# Altium schematic sheet Sensors.SchDoc
size A3; SheetNumber: 1; SheetTotal: 3
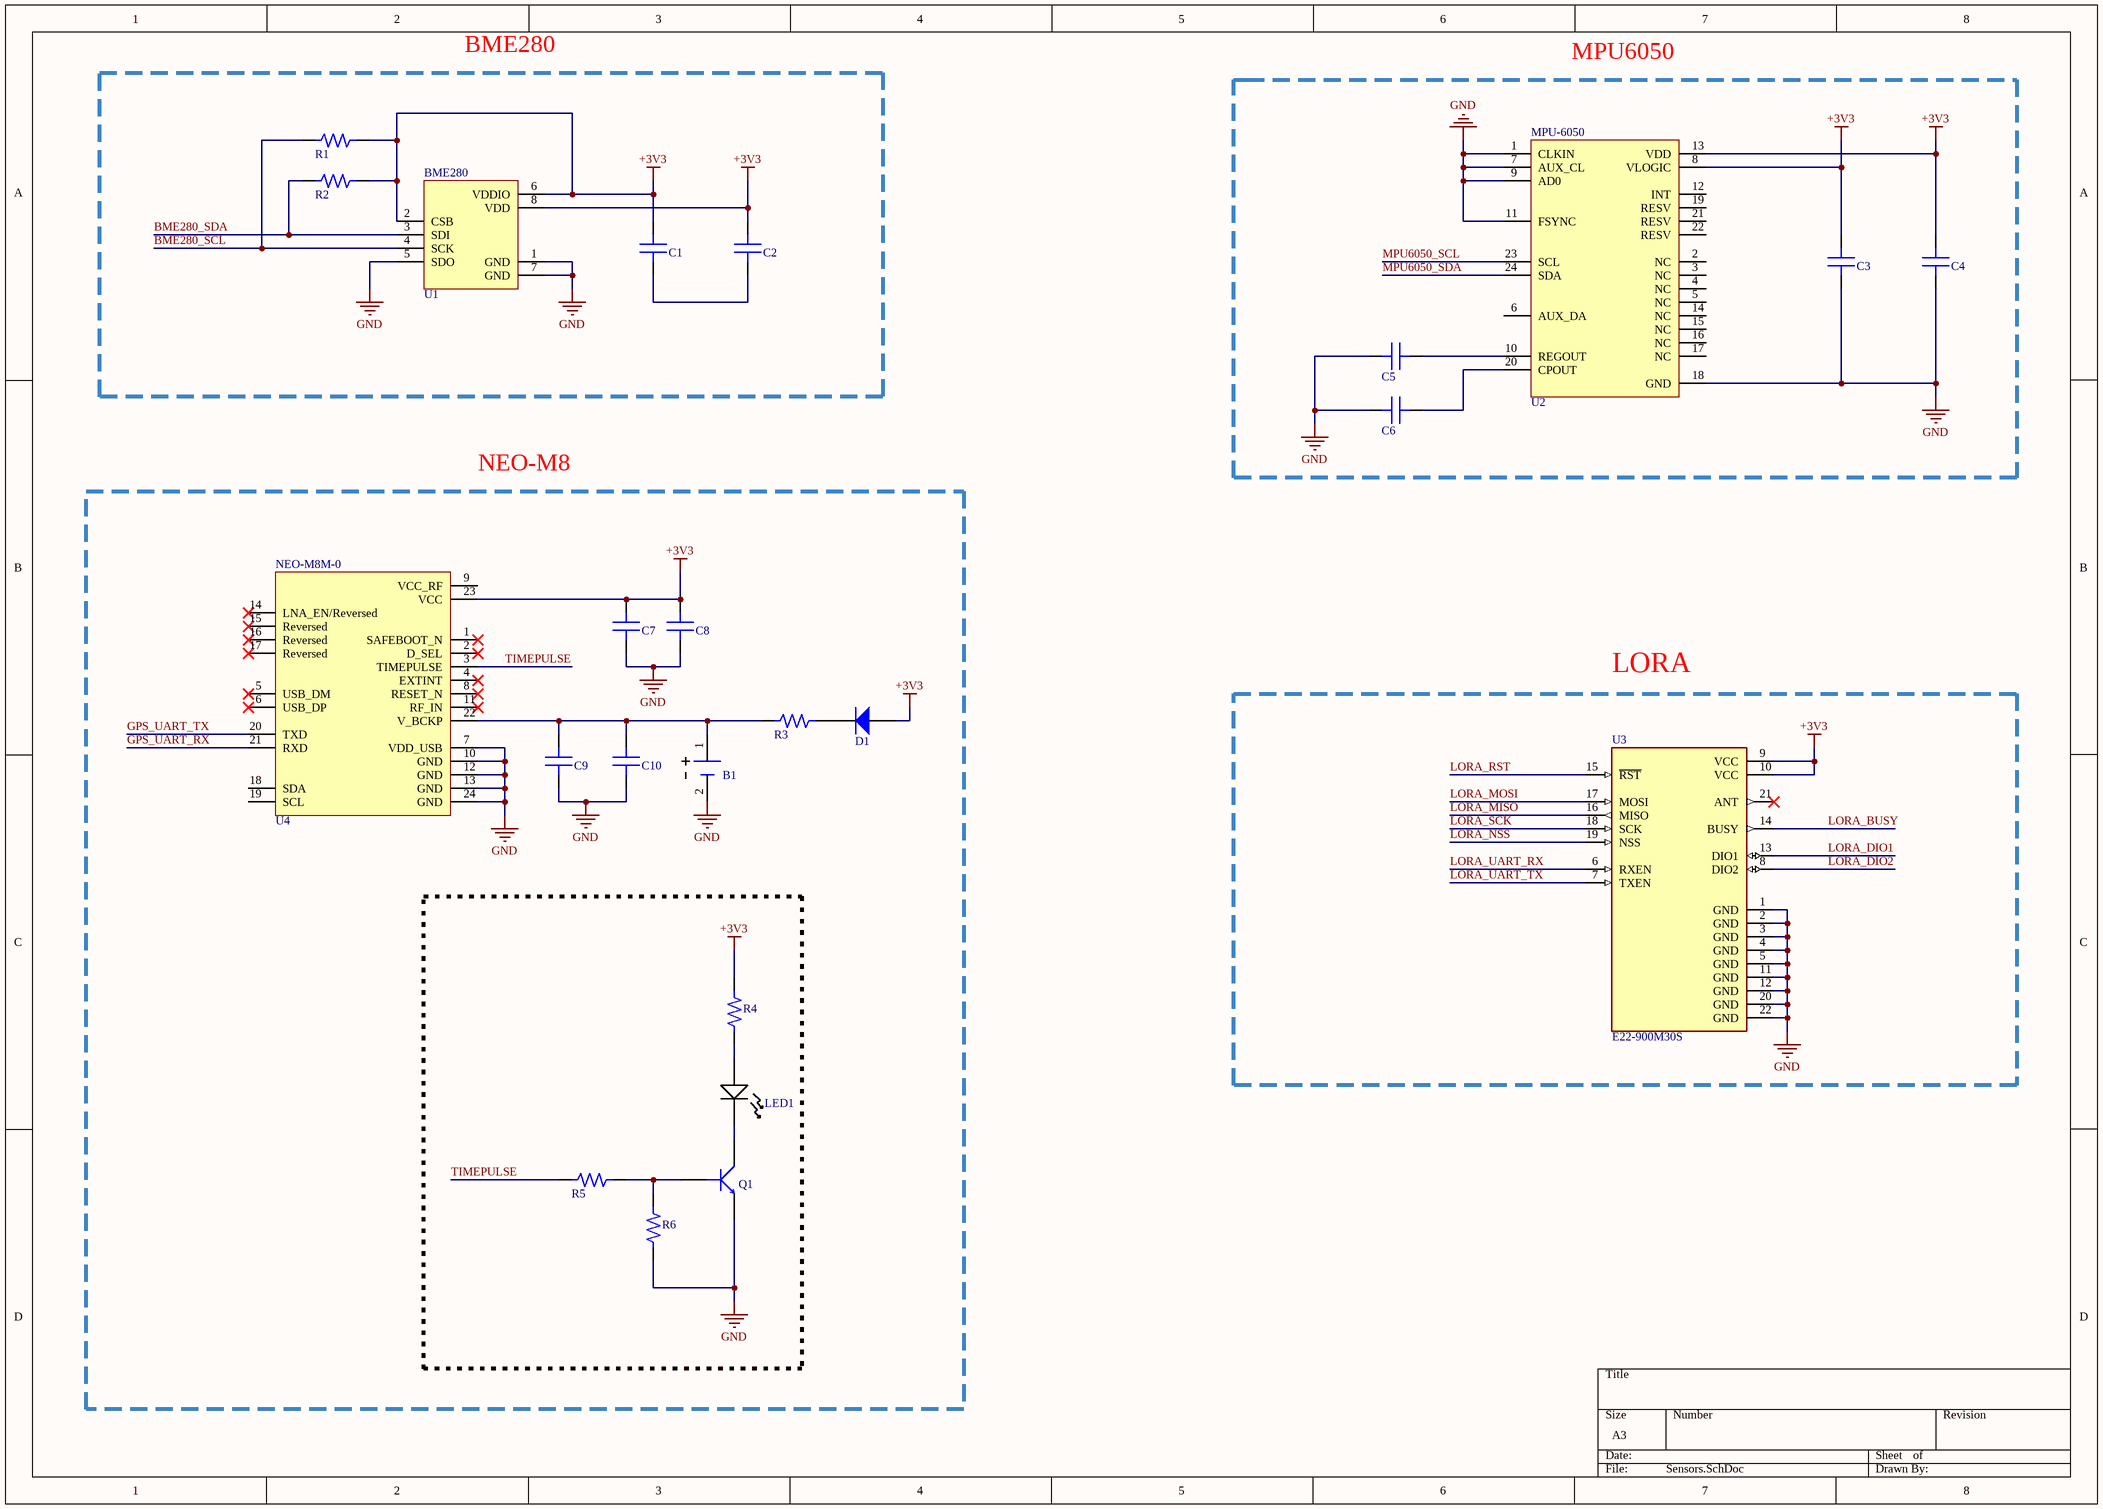
[diagram p0: Sensors.SchDoc]

## Parts
B1  MS920SE-FL27E  [MS920SE_Battery]  (value not drawn)
C1  CAP CER 100nF 0805  [CAP_0805]  (value not drawn)
C2  CAP CER 100nF 0805  [CAP_0805]  (value not drawn)
C3  CAP CER 10nF 0805  [CAP_0805]  (value not drawn)
C4  CAP CER 0.1uF 0805  [CAP_0805]  (value not drawn)
C5  CAP CER 0.1uF 0805  [CAP_0805]  (value not drawn)
C6  CAP CER 2.2nF 0805  [CAP_0805]  (value not drawn)
C7  CAP CER 10uF 0805  [CAP_0805]  (value not drawn)
C8  CAP CER 100nF 0805  [CAP_0805]  (value not drawn)
C9  CAP CER 4.7uF 0805  [CAP_0805]  (value not drawn)
C10  CAP CER 100nF 0805  [CAP_0805]  (value not drawn)
D1  DIODE GEN PURP 75V 150MA SOD323F  [SOD323F]  (value not drawn)
LED1  CMD17-21VRD/TR8  [LED RED_0805]  (value not drawn)
Q1  MMBT3904-7-F  [SOT_23F]  (value not drawn)
R1  RES 4.7K OHM 0805  [RES_0805]  (value not drawn)
R2  RES 4.7K OHM 0805  [RES_0805]  (value not drawn)
R3  RES 1K OHM 0805  [RES_0805]  (value not drawn)
R4  RES 1K OHM 0805  [RES_0805]  (value not drawn)
R5  RES 10K OHM 0805  [RES_0805]  (value not drawn)
R6  RES 10K OHM 0805  [RES_0805]  (value not drawn)
U1  BME280  [BME280]
U2  MPU-6050  [QFN-24-MPU6050]
U3  E22-900M30S  [LORA]
U4  NEO-M8M-0  [NEO-M8-GPS]

## Blocks framed on the sheet
BME280: C1 C2 R1 R2 U1
MPU6050: C3-C6 U2
NEO-M8: B1 C7-C10 D1 LED1 Q1 R3-R6 U4
LORA: U3

## Nets
+3V3: C1.2 C2.2 C3.2 C4.2 C7.2 C8.2 D1.2(ANODE) R1.2 R2.2 R4.2 U1.2(CSB) U1.6(VDDIO) U1.8(VDD) U2.8(VLOGIC) U2.13(VDD) U3.9(VCC) U3.10(VCC) U4.23(VCC)
GND: B1.2 C3.1 C4.1 C5.1 C6.1 C7.1 C8.1 C9.1 C10.1 Q1.2(E) R6.1 U1.1(GND) U1.5(SDO) U1.7(GND) U2.1(CLKIN) U2.7(AUX_CL) U2.9(AD0) U2.11(FSYNC) U2.18(GND) U3.1(GND) U3.2(GND) U3.3(GND) U3.4(GND) U3.5(GND) U3.11(GND) U3.12(GND) U3.20(GND) U3.22(GND) U4.7(VDD_USB) U4.10(GND) U4.12(GND) U4.13(GND) U4.24(GND)
BME280_SCL: R1.1 U1.4(SCK)
BME280_SDA: R2.1 U1.3(SDI)
GPS_UART_RX: U4.21(RXD)
GPS_UART_TX: U4.20(TXD)
LORA_BUSY: U3.14(BUSY)
LORA_DIO1: U3.13(DIO1)
LORA_DIO2: U3.8(DIO2)
LORA_MISO: U3.16(MISO)
LORA_MOSI: U3.17(MOSI)
LORA_NSS: U3.19(NSS)
LORA_RST: U3.15(~{RST})
LORA_SCK: U3.18(SCK)
LORA_UART_RX: U3.6(RXEN)
LORA_UART_TX: U3.7(TXEN)
MPU6050_SCL: U2.23(SCL)
MPU6050_SDA: U2.24(SDA)
TIMEPULSE: R5.1 U4.3(TIMEPULSE)
NetB1_1: B1.1 C9.2 C10.2 R3.1 U4.22(V_BCKP)
NetC1_1: C1.1 C2.1
NetC5_2: C5.2 U2.10(REGOUT)
NetC6_2: C6.2 U2.20(CPOUT)
NetD1_1: D1.1(CATHODE) R3.2
NetLED1_1: LED1.1 R4.1
NetLED1_2: LED1.2 Q1.3(C)
NetQ1_1: Q1.1(B) R5.2 R6.2

Not connected (* = marked no-connect by the designer): U2 2(NC) 3(NC) 4(NC) 5(NC) 6(AUX_DA) 12(INT) 14(NC) 15(NC) 16(NC) 17(NC) 19(RESV) 21(RESV) 22(RESV); U3 21(ANT)*; U4 1(SAFEBOOT_N)* 2(D_SEL)* 4(EXTINT)* 5(USB_DM)* 6(USB_DP)* 8(RESET_N)* 9(VCC_RF) 11(RF_IN)* 14(LNA_EN/Reversed)* 15(Reversed)* 16(Reversed)* 17(Reversed)* 18(SDA) 19(SCL)

## Notes on the sheet
- (near R1) SDO nun GND ye bağlanması sonucu slave adres 1110110(0x76) olur
- (near U4) USB İLE DEĞİL UART İLE HABERLEŞİYOR
- RF antenlerle ilgili olmalı?
- (near U4) KULLANILACAK MI ? UART İÇİN RX-TX KULLANILIYOR..
- SORU İŞARETİ???
  XBEE İŞLEMCİYE GİTMEDEN ÖNCE KONNEKTÖRE GİDECEK
  İŞLEMCİ - USB - KONNEKTÖR
  acaba xbee den çıkan rx tx pinleri usb to uart yaptığımız ch340n den çıkan rx tx pinlerine mi gidecek????
- https://image.easyeda.com/components/a3499788020748ef87e202bcfc8d7515.png

## Library data of the parts
B1 = BATTERY: Lithium Battery Coin 3V 11mAh Rechargeable Tray; Manufacturer: Epson; Capacity: 0.011ah; Number of Cells: 1; Supplier 1: Digi-Key; Manufacturer Part Number: MS920SE-FL27E; RoHS: No; Stock 1: 17863; Pricing 1: 1=2,520000, 10=2,091000, 50=1,844000, 100=1,741000, 300=1,617400, 500=1,535000, 1000=1,452580, 2500=1,380470 (USD); Mount: Screw; Min Operating Temperature: -20°C; Max Operating Temperature: 60°C; Chemistry/Technology: Lithium; Voltage: 3V; ComponentLink1URL: http://speed.sii.co.jp/data/file_PRODUCT_MASTER_50112_TITLE_IMAGESP.pdf?src-supplier=Avnet; ComponentLink1Description: http://speed.sii.co.jp/data/file_PRODUCT_MASTER_50112_TITLE_IMAGESP.pdf?src-supplier=Avnet; Supplier Part Number 1: 728-1058-ND
D1 = DIODE: VR=75V IF=150mA Trr=4ns P=200mW; Manufacturer: ON Semiconductor / Fairchild; Manufacturer Part Number: 1N4148WS; Element Configuration: Single; Reverse Recovery Time: 4ns; Forward Voltage: 1V; Max Reverse Current: 5uA; Power Dissipation: 200mW; Max Forward Surge Current (Ifsm): 2A; Supplier 1: Digi-Key; RoHS: Yes; Category: Rectifier Diodes; Stock 1: 973654; Pricing 1: 1=0,21000, 10=0,19200, 100=0,10460, 500=0,06436, 1000=0,04388 (USD); Mount: Surface Mount; Number of Pins: 2; Contact Plating: Tin,Matte; Weight: 0.0276g; Min Operating Temperature: -55°C; Max Operating Temperature: 150°C; Packaging: Tape and Reel; Forward Current: 150mA; Max Repetitive Reverse Voltage (Vrrm): 75V; Package Quantity: 1; Average Rectified Current: 150mA; Max Reverse Voltage (DC): 75V; Recovery Time: 4ns; Series: -; Reverse Voltage: 75V; Length: 1.8mm; Width: 1.35mm; Height: 1mm; Radiation Hardening: No; RoHS Compliant: Yes; Lead Free: Lead Free; Reach SVHC Compliant: Yes; ComponentLink1URL: https://datasheet.ciiva.com/30479/0900766b810e1cd3-30479206.pdf?src-supplier=Rs; ComponentLink1Description: https://datasheet.ciiva.com/30479/0900766b810e1cd3-30479206.pdf?src-supplier=Rs; ComponentLink2URL: https://datasheet.ciiva.com/15208/getdatasheetpartid-127819-15208358.pdf?src-supplier=Verical; ComponentLink2Description: https://datasheet.ciiva.com/15208/getdatasheetpartid-127819-15208358.pdf?src-supplier=Verical; ComponentLink3URL: https://datasheet.ciiva.com/8300/1n914bws-8300360.pdf?src-supplier=Avnet; ComponentLink3Description: https://datasheet.ciiva.com/8300/1n914bws-8300360.pdf?src-supplier=Avnet; ComponentLink4URL: https://datasheet.ciiva.com/910/1n4148ws-910381.pdf?src-supplier=Digi-Key; ComponentLink4Description: https://datasheet.ciiva.com/910/1n4148ws-910381.pdf?src-supplier=Digi-Key; ComponentLink5URL: https://datasheet.ciiva.com/910/1n4148ws-910382.pdf?src-supplier=Digi-Key; ComponentLink5Description: https://datasheet.ciiva.com/910/1n4148ws-910382.pdf?src-supplier=Digi-Key; ComponentLink6URL: https://datasheet.ciiva.com/910/1n4148ws-910380.pdf?src-supplier=Digi-Key; ComponentLink6Description: https://datasheet.ciiva.com/910/1n4148ws-910380.pdf?src-supplier=Digi-Key; Supplier Part Number 1: 1N4148WSFSDKR-ND
LED1 = LED RED: LED Uni-Color Red 640nm 2-Pin SMT T/R; Manufacturer: VCC CHML; Power Rating: 100mW; Luminous Intensity: 6mcd; Viewing Angle: 140°; Lens Style: Diffused,Tinted,Rectangular,Colored; Forward Current: 20mA; Forward Voltage: 2V; Reverse Voltage (DC): 5V; Number of LEDs: 1; Supplier 1: Digi-Key; Manufacturer Part Number: CMD17-21VRD/TR8; RoHS: Yes; Category: LEDs; Stock 1: 357228; Pricing 1: 1=0,73000, 10=0,47800, 100=0,31310, 1000=0,24720 (USD); Mount: Surface Mount; Case/Package: 0805; Number of Pins: 2; Color: Red; Case Code (Metric): 2012; Case Code (Imperial): 0805; Lens Color: Red; Min Operating Temperature: -40°C; Max Operating Temperature: 85°C; Packaging: Tape and Reel; Package Quantity: 1; Illumination Color: Red; Test Current: 20mA; Wavelength: 640nm; Reverse Voltage: 5V; Length: 2mm; Width: 1.25mm; Height: 1.1mm; RoHS Compliant: Yes; Lead Free: Lead Free; ComponentLink1URL: http://www.mouser.com/ds/2/423/CMD1721ver1-1064576.pdf?src-supplier=Mouser; ComponentLink1Description: http://www.mouser.com/ds/2/423/CMD1721ver1-1064576.pdf?src-supplier=Mouser; ComponentLink2URL: https://www.alliedelec.com/m/d/ea8f758becbd32522d2612194452bcae.pdf?src-supplier=Allied+Electronics; ComponentLink2Description: https://www.alliedelec.com/m/d/ea8f758becbd32522d2612194452bcae.pdf?src-supplier=Allied+Electronics; ComponentLink3URL: http://www.onlinecomponents.com/productFiles/mf-CM/2cmd17-21seriessmtleds0805packagesize.pdf?src-supplier=Onlinecomponents.com; ComponentLink3Description: http://www.onlinecomponents.com/productFiles/mf-CM/2cmd17-21seriessmtleds0805packagesize.pdf?src-supplier=Onlinecomponents.com; ComponentLink4URL: https://vcclite.com/wp-content/uploads/wpallimport/files/files/CMD1721Seriesver3.pdf?src-supplier=Digi-Key; ComponentLink4Description: https://vcclite.com/wp-content/uploads/wpallimport/files/files/CMD1721Seriesver3.pdf?src-supplier=Digi-Key; Supplier Part Number 1: L62501CT-ND
Q1 = BJT_NPN: NPN Ic=200mA Vceo=40V hfe=100~300 fT=310MHz P=300mW SOT-23; Manufacturer: Diodes Zetex; Max Power Dissipation: 300mW; Collector Emitter Voltage (VCEO): 40V; Max Collector Current: 200mA; Collector Base Voltage (VCBO): 60V; Power Dissipation: 350mW; Frequency: 300MHz; hFE Min: 100; Number of Elements: 1; Emitter Base Voltage (VEBO): 6V; Collector Emitter Saturation Voltage: 300mV; Element Configuration: Single; Supplier 1: Digi-Key; Manufacturer Part Number: MMBT3904-7-F; RoHS: Yes; Category: BJTs; Stock 1: 7729144; Pricing 1: 1=0,13000, 10=0,11700, 100=0,06370, 500=0,03918, 1000=0,02671 (USD); Mount: Surface Mount; Case/Package: SOT-23; Number of Pins: 3; Weight: 0.000282oz; Contact Plating: Tin,Matte; Min Operating Temperature: -55°C; Max Operating Temperature: 150°C; Polarity: NPN; Packaging: Tape and Reel; Package Quantity: 3000; Transition Frequency: 300MHz; Collector Emitter Breakdown Voltage: 40V; Max Breakdown Voltage: 40V; Continuous Collector Current: 200mA; Max Frequency: 300MHz; Gain Bandwidth Product: 300MHz; Voltage Rating (DC): 40V; Series: Automotive, AEC-Q101; Collector-emitter Voltage-Max: 300mV; Length: 3.05mm; Width: 1.4mm; Height: 1mm; Radiation Hardening: No; Reach SVHC Compliant: Yes; Lead Free: Lead Free; RoHS Compliant: Yes; ComponentLink1URL: https://datasheet.ciiva.com/11201/ds30036-11201778.pdf?src-supplier=Avnet; ComponentLink1Description: https://datasheet.ciiva.com/11201/ds30036-11201778.pdf?src-supplier=Avnet; ComponentLink2URL: https://datasheet.ciiva.com/15138/getdatasheetpartid-53265-15138780.pdf?src-supplier=Verical; ComponentLink2Description: https://datasheet.ciiva.com/15138/getdatasheetpartid-53265-15138780.pdf?src-supplier=Verical; ComponentLink3URL: https://datasheet.ciiva.com/22711/1915516-22711750.pdf?src-supplier=Element14; ComponentLink3Description: https://datasheet.ciiva.com/22711/1915516-22711750.pdf?src-supplier=Element14; ComponentLink4URL: https://datasheet.ciiva.com/11198/ds30036-11198999.pdf?src-supplier=Avnet; ComponentLink4Description: https://datasheet.ciiva.com/11198/ds30036-11198999.pdf?src-supplier=Avnet; ComponentLink5URL: https://datasheet.ciiva.com/6361/ds30036-6361256.pdf?src-supplier=Digi-Key; ComponentLink5Description: https://datasheet.ciiva.com/6361/ds30036-6361256.pdf?src-supplier=Digi-Key; ComponentLink6URL: https://datasheet.ciiva.com/6361/ds30036-6361254.pdf?src-supplier=Digi-Key; ComponentLink6Description: https://datasheet.ciiva.com/6361/ds30036-6361254.pdf?src-supplier=Digi-Key; Supplier Part Number 1: MMBT3904-FDICT-ND
U1 = BME280: Pressure, Temperature and Humidity Sensor Digital Output 1.8V 8-Pin LGA T/R; Manufacturer: Bosch Tools; Supplier 1: Digi-Key; Manufacturer Part Number: BME280; RoHS: No; Category: Pressure Sensors; Stock 1: 180730; Pricing 1: 1=7,64000, 5=6,74200, 10=5,95500, 25=4,83160, 50=4,26960, 100=4,15730, 500=3,48316, 1000=3,25844 (USD); Supplier Part Number 1: 828-1063-1-ND
U2 = MPU6050: IMU ACCEL/GYRO 3-AXIS I2C 24QFN; Manufacturer: TDK InvenSense; Sensor Type: Accelerometer,Gyroscope,6 Axis; Supplier 1: Digi-Key; Manufacturer Part Number: MPU-6050; RoHS: Yes; Category: Inertial Measurement Units (IMUs); Pricing 1: 1=9,11000, 5=7,99200, 10=7,19300, 25=6,39400, 50=5,91440, 100=5,11520, 500=4,79550, 1000=4,47580 (USD); Mount: Surface Mount; Case/Package: QFN; Min Operating Temperature: -40°C; Max Operating Temperature: 85°C; Packaging: Cut Tape; Output Type: I2C; Series: -; RoHS Compliant: Yes; ComponentLink1URL: https://datasheet.ciiva.com/1513/1788002-1513632.pdf?src-supplier=Element14; ComponentLink1Description: https://datasheet.ciiva.com/1513/1788002-1513632.pdf?src-supplier=Element14; ComponentLink2URL: https://datasheet.ciiva.com/22731/1788002-22731434.pdf?src-supplier=Element14; ComponentLink2Description: https://datasheet.ciiva.com/22731/1788002-22731434.pdf?src-supplier=Element14; Supplier Part Number 1: 1428-1007-1-ND
U3 = LORA: SX1262 868/915 MHz 1w SPI LoRa Module; MF: EBYTE; Value: *; SnapEDA_Link: https://www.snapeda.com/parts/E22-900M30S/EBYTE/view-part/?ref=snap; Availability: Not in stock; Price: None; Check_prices: https://www.snapeda.com/parts/E22-900M30S/EBYTE/view-part/?ref=eda; Package: Package; MP: E22-900M30S
U4 = NEO-M8: Rf Rcvr Gnss/gps 1.575GHZ 24LCC; Manufacturer: u-blox; Interface: I2C,SPI,USB,UART; Sensitivity: -167dBm; Current - Receiving: 21mA; Supplier 1: Digi-Key; Manufacturer Part Number: NEO-M8M-0; RoHS: Yes; Category: RF Receivers, Transceivers; Stock 1: 3000; Pricing 1: 1=27,00000, 10=19,61000, 50=16,10000, 100=12,89000 (USD); Case/Package: SMD/SMT; Min Operating Temperature: -40°C; Max Operating Temperature: 85°C; Packaging: Tape and Reel; Frequency: 1.575GHz; ComponentLink1URL: https://www.u-blox.com/sites/default/files/products/documents/NEO-M8-FW3_ProductSummary_%28UBX-16000345%29.pdf?src-supplier=Digi-Key; ComponentLink1Description: https://www.u-blox.com/sites/default/files/products/documents/NEO-M8-FW3_ProductSummary_%28UBX-16000345%29.pdf?src-supplier=Digi-Key; ComponentLink2URL: https://www.u-blox.com/sites/default/files/NEO-M8-FW3_DataSheet_%28UBX-15031086%29.pdf?src-supplier=Digi-Key; ComponentLink2Description: https://www.u-blox.com/sites/default/files/NEO-M8-FW3_DataSheet_%28UBX-15031086%29.pdf?src-supplier=Digi-Key; Supplier Part Number 1: 672-NEO-M8M-0CT-ND